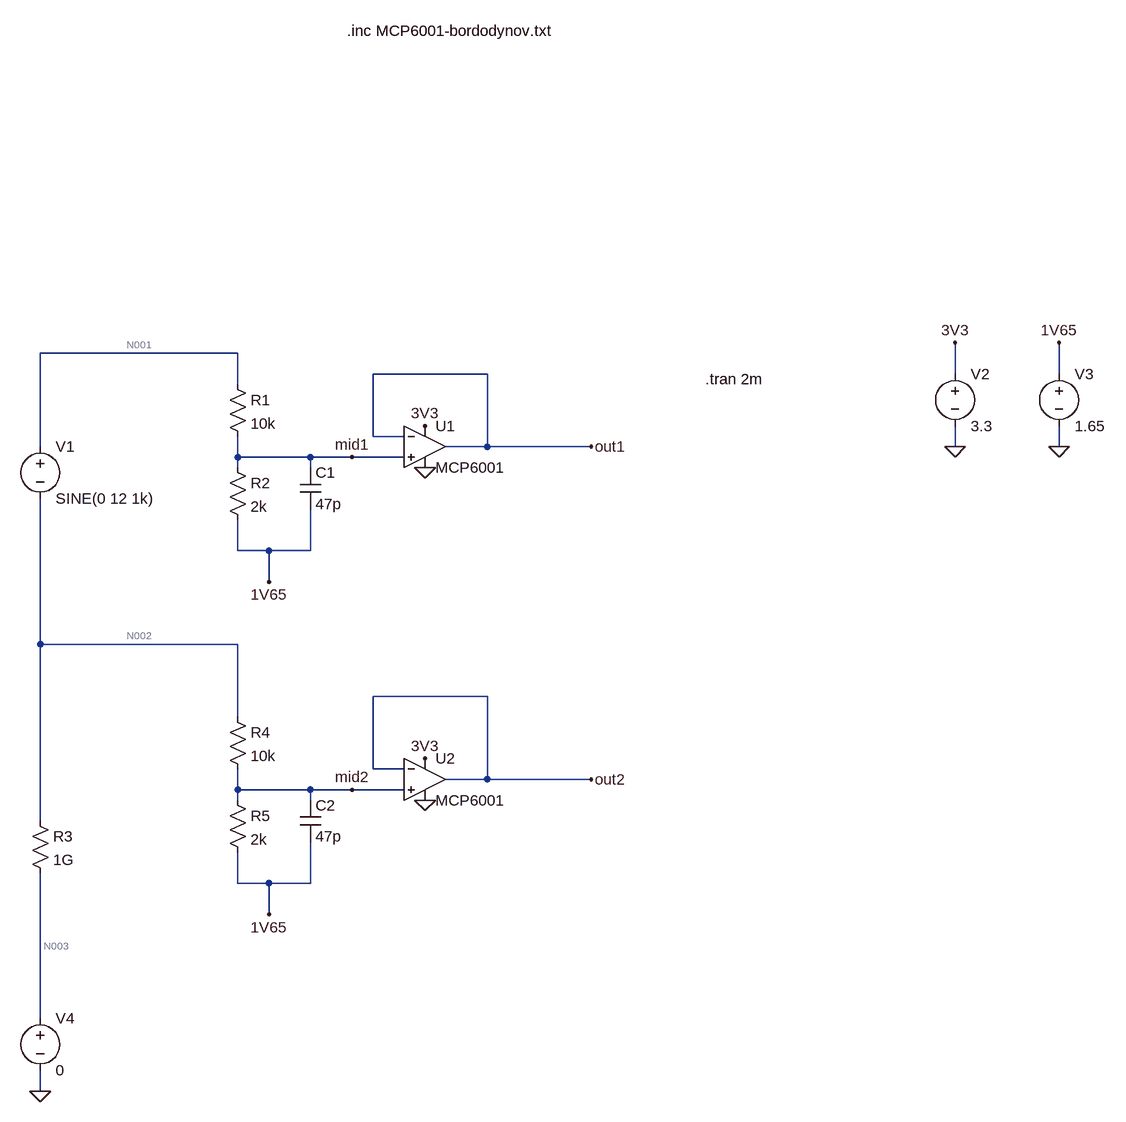
[diagram p0: schematic diffamp_voltages.asc]
diffamp_voltages.asc, the LTspice schematic file:
Version 4.1
SHEET 1 1540 1172
WIRE 176 16 -128 16
WIRE 560 48 384 48
WIRE 1280 48 1280 0
WIRE 1440 48 1440 0
WIRE 176 64 176 16
WIRE 384 144 384 48
WIRE 432 144 384 144
WIRE -128 160 -128 16
WIRE 560 160 560 48
WIRE 560 160 496 160
WIRE 720 160 560 160
WIRE 1280 160 1280 128
WIRE 1440 160 1440 128
WIRE 176 176 176 144
WIRE 288 176 176 176
WIRE 352 176 288 176
WIRE 432 176 352 176
WIRE 176 192 176 176
WIRE 288 192 288 176
WIRE 176 320 176 272
WIRE 224 320 176 320
WIRE 288 320 288 256
WIRE 288 320 224 320
WIRE 224 368 224 320
WIRE -128 464 -128 240
WIRE 176 464 -128 464
WIRE 560 544 384 544
WIRE 176 576 176 464
WIRE 384 656 384 544
WIRE 432 656 384 656
WIRE 560 672 560 544
WIRE 560 672 496 672
WIRE 720 672 560 672
WIRE 176 688 176 656
WIRE 288 688 176 688
WIRE 352 688 288 688
WIRE 432 688 352 688
WIRE 176 704 176 688
WIRE 288 704 288 688
WIRE -128 736 -128 464
WIRE 176 832 176 784
WIRE 224 832 176 832
WIRE 288 832 288 768
WIRE 288 832 224 832
WIRE 224 880 224 832
WIRE -128 1040 -128 816
WIRE -128 1152 -128 1120
FLAG 1280 160 0
FLAG 1280 0 3V3
FLAG 464 128 3V3
FLAG 464 192 0
FLAG 1440 160 0
FLAG 1440 0 1V65
FLAG 720 160 out1
FLAG 464 640 3V3
FLAG 464 704 0
FLAG 720 672 out2
FLAG 224 368 1V65
FLAG 224 880 1V65
FLAG 352 176 mid1
FLAG 352 688 mid2
FLAG -128 1152 0
SYMBOL res 160 48 R0
SYMATTR InstName R1
SYMATTR Value 10k
SYMBOL res 160 176 R0
SYMATTR InstName R2
SYMATTR Value 2k
SYMBOL cap 272 192 R0
SYMATTR InstName C1
SYMATTR Value 47p
SYMBOL voltage -128 144 R0
WINDOW 123 0 0 Left 0
WINDOW 39 0 0 Left 0
SYMATTR InstName V1
SYMATTR Value SINE(0 12 1k)
SYMBOL OpAmps\\opamp2 464 96 R0
SYMATTR InstName U1
SYMATTR Value MCP6001
SYMBOL voltage 1280 32 R0
WINDOW 123 0 0 Left 0
WINDOW 39 0 0 Left 0
SYMATTR InstName V2
SYMATTR Value 3.3
SYMBOL res -144 720 R0
SYMATTR InstName R3
SYMATTR Value 1G
SYMBOL voltage 1440 32 R0
WINDOW 123 0 0 Left 0
WINDOW 39 0 0 Left 0
SYMATTR InstName V3
SYMATTR Value 1.65
SYMBOL res 160 560 R0
SYMATTR InstName R4
SYMATTR Value 10k
SYMBOL res 160 688 R0
SYMATTR InstName R5
SYMATTR Value 2k
SYMBOL cap 272 704 R0
SYMATTR InstName C2
SYMATTR Value 47p
SYMBOL OpAmps\\opamp2 464 608 R0
SYMATTR InstName U2
SYMATTR Value MCP6001
SYMBOL voltage -128 1024 R0
WINDOW 123 0 0 Left 0
WINDOW 39 0 0 Left 0
SYMATTR InstName V4
SYMATTR Value 0
TEXT 896 56 Left 2 !.tran 2m
TEXT 344 -480 Left 2 !.inc MCP6001-bordodynov.txt

The netlist it stands for:
* diffamp_voltages.asc
R1 N001 mid1 10k
R2 mid1 1V65 2k
C1 mid1 1V65 47p
V1 N001 N002 SINE(0 12 1k)
X§U1 mid1 out1 3V3 0 out1 MCP6001  ; pins In+ In- V+ V- OUT
V2 3V3 0 3.3
R3 N002 N003 1G
V3 1V65 0 1.65
R4 N002 mid2 10k
R5 mid2 1V65 2k
C2 mid2 1V65 47p
X§U2 mid2 out2 3V3 0 out2 MCP6001  ; pins In+ In- V+ V- OUT
V4 N003 0 0
.tran 2m
.inc MCP6001-bordodynov.txt
.backanno
.end

* Results of the author's LTspice run, read from the files saved beside the schematic
* Operating Point, zero values left out:
*   V(1v65) = 1.65 V
*   V(3v3) = 3.3 V
*   V(mid1) = 1.65 V
*   V(mid2) = 1.65 V
*   V(n001) = 1.65 V
*   V(n002) = 1.65 V
*   V(out1) = 1.649 V
*   V(out2) = 1.649 V
*   I(R1) = -825 pA
*   I(R2) = -825.7 pA
*   I(R3) = 1.65 nA
*   I(R4) = -825 pA
*   I(R5) = -825.7 pA
*   I(V1) = 825 pA
*   I(V2) = -217.5 µA
*   I(V3) = -1.651 nA
*   I(V4) = 1.65 nA
*   Ix(u1:3) = 108.7 µA
*   Ix(u1:4) = -108.7 µA
*   Ix(u2:3) = 108.7 µA
*   Ix(u2:4) = -108.7 µA
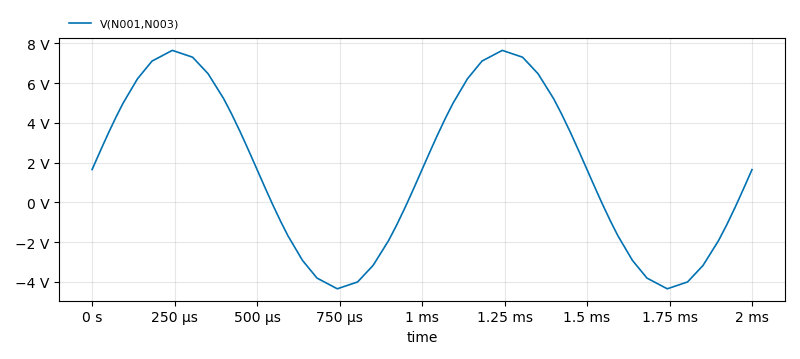
[diagram p1: Transient Analysis of diffamp_voltages.asc, plotted from the saved traces]
* Transient Analysis, 1 run:
*   V(N001,N003): min -4.344 V, max 7.644 V, average 1.65 V, rms 4.529 V, last 1.65 V